# Altium schematic sheet Stepper_control_board_v100.SchDoc
size A3
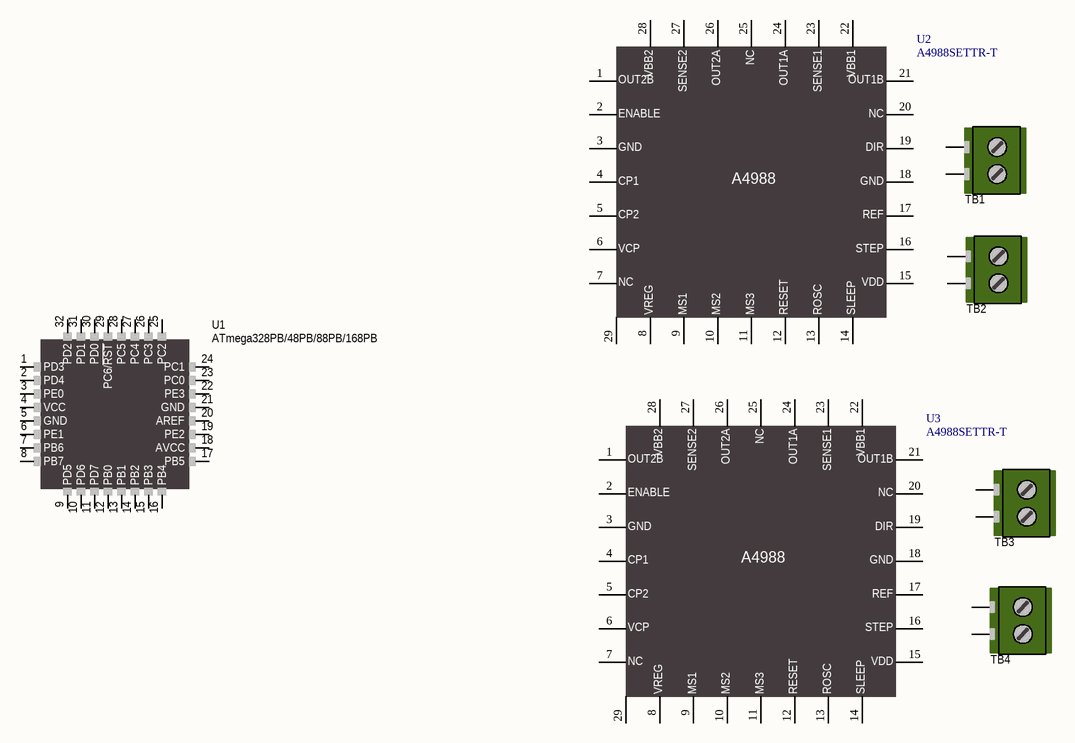
[diagram p0: Stepper_control_board_v100.SchDoc]

## Parts
TB1  282834-2  [SCREW TERMINAL 2.54]  (value not drawn)
TB2  282834-2  [SCREW TERMINAL 2.54]  (value not drawn)
TB3  282834-2  [SCREW TERMINAL 2.54]  (value not drawn)
TB4  282834-2  [SCREW TERMINAL 2.54]  (value not drawn)
U1  ATmega328PB/48PB/88PB/168PB  [QFP32P80_900X900X120L60X37N]
U2  A4988SETTR-T  [QFN50P500X500X100_HS-29N]
U3  A4988SETTR-T  [QFN50P500X500X100_HS-29N]

## Nets

Not connected (* = marked no-connect by the designer): TB1 1 2; TB2 1 2; TB3 1 2; TB4 1 2; U1 1(PD3) 2(PD4) 3(PE0) 4(VCC) 5(GND) 6(PE1) 7(PB6) 8(PB7) 9(PD5) 10(PD6) 11(PD7) 12(PB0) 13(PB1) 14(PB2) 15(PB3) 16(PB4) 17(PB5) 18(AVCC) 19(PE2) 20(AREF) 21(GND) 22(PE3) 23(PC0) 24(PC1) 25(PC2) 26(PC3) 27(PC4) 28(PC5) 29(PC6/~{RST}) 30(PD0) 31(PD1) 32(PD2); U2 1 2 3 4 5 6 7 8 9 10 11 12 13 14 15 16 17 18 19 20 21 22 23 24 25 26 27 28 29; U3 1 2 3 4 5 6 7 8 9 10 11 12 13 14 15 16 17 18 19 20 21 22 23 24 25 26 27 28 29

## Notes on the sheet
- Project:
- Mylossh Electronics
- P. A. Čarnojevića 116B
- Design Engineer:
- Date:
- GitHub:
- https://github.com/Mylossh
- Miloš Ilić
- Time:
- Size:
- Sheet 1 of 1
- A3
- REV:
- 1.0
- 26230 Omoljica
- Serbia
- (in symbol 0100000079072) VBB2; SENSE2; OUT2A; NC; OUT1A; SENSE1; VBB1; OUT2B; OUT1B; ENABLE; GND; DIR; CP1; A4988; CP2; REF; VCP; STEP; VDD; VREG; MS1; MS2; MS3; RESET; ROSC; SLEEP

## Library data of the parts
TB1-TB4 = 0100000003800: TERM BLOCK 2POS SIDE ENT 2.54MM; Manufacturer: TE Connectivity AMP Connectors; id: 56; Assembly: TH; Pitch: 0.100" (2.54mm); item_id: 646; Number of Levels: 1; Positions Per Level: 2; Barcode: 0100000003800; Manufacturer Part Number: 282834-2; Category: Connectors, Interconnects; Datasheet URL: http://www.te.com/commerce/DocumentDelivery/DDEController?Action=srchrtrv&DocNm=282834&DocType=Customer+Drawing&DocLang=English; Family: TERMINAL BLOCK; Part Type: Connectors, Electromechanical; Color: Green; Features: -; Mounting Type: Through Hole
U1 = 3500000139108: IC MCU 8BIT 8KB FLASH 32TQFP; Manufacturer: Microchip Technology; Manufacturer Part Number: ATMEGA88PB-AU; id: 1142; Assembly: SMD; Core Processor: AVR; Core Size: 8-Bit; Speed: 20MHz; Connectivity: I²C, SPI, UART/USART; Peripherals: Brown-out Detect/Reset, POR, PWM, WDT; Voltage  Supply Vcc Vdd: 1.8 V ~ 5.5 V; Number of I O: 27; item_id: 12043; Program Memory Size: 8KB (4K x 16); Barcode: 3500000139108; Category: Integrated Circuits (ICs); Datasheet URL: http://www.atmel.com/Images/Atmel-42176-ATmega48PB-88PB-168PB_Datasheet.pdf; Package Case: 32-TQFP; Family: Microcontrollers; Part Type: Integrated Circuits; Program Memory Type: FLASH
U2 U3 = 0100000079072: IC MOTOR DRIVER PAR 28QFN; Manufacturer: Allegro MicroSystems, LLC; id: 994; Assembly: SMD; Function: Driver - Fully Integrated, Control and Power Stage; Current  Output: 2A; Voltage  Supply: 3 V ~ 5.5 V; Interface: Step/Direction; Output Configuration: Half Bridge (4); Motor Type  Stepper: Bipolar; Voltage Load: 8 V ~ 35 V; item_id: 7051; Barcode: 0100000079072; Manufacturer Part Number: A4988SETTR-T; Category: Integrated Circuits (ICs); Datasheet URL: http://www.allegromicro.com/en/Products/Part_Numbers/4988/4988.pdf; Package Case: 28-VFQFN Exposed Pad; Family: Motor Drivers, Controllers; Technology: DMOS; Motor Type AC DC: -; Part Type: Integrated Circuits; Applications: General Purpose